# Altium schematic sheet CON_NANOTALK_10WHDRRAMx2.SchDoc: NanoTalk JTAG Headers
size A4; Organization: Altium Limited.; Address1: Level 3, 12a Rodborough Rd; Address2: Frenchs Forest 2086; Address3: NSW; Address4: AUSTRALIA; SheetNumber: 1; SheetTotal: 100
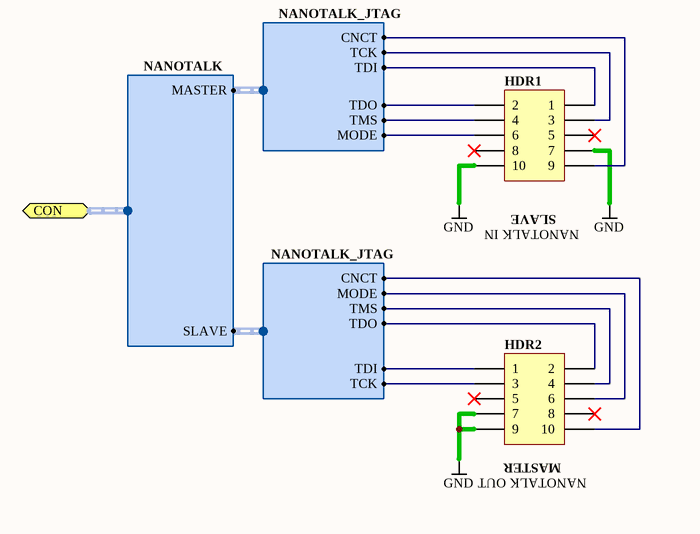
[diagram p0: CON_NANOTALK_10WHDRRAMx2.SchDoc]

## Parts
HDR1  2x5 RA HEADER MALE  [918510x323]  (value not drawn)
HDR2  2x5 RA HEADER  [918510x323]  (value not drawn)

## Ports
CON (harness NANOTALK)

## Harnesses
NANOTALK: MASTER, SLAVE
NANOTALK_JTAG: TDI, TCK, TMS, TDO, MODE, CNCT

## Nets
GND: HDR1.7 HDR1.10 HDR2.7 HDR2.9
NetHDR1_1: HDR1.1 ; harness NANOTALK_JTAG.TDI
NetHDR1_2: HDR1.2 ; harness NANOTALK_JTAG.TDO
NetHDR1_3: HDR1.3 ; harness NANOTALK_JTAG.TCK
NetHDR1_4: HDR1.4 ; harness NANOTALK_JTAG.TMS
NetHDR1_6: HDR1.6 ; harness NANOTALK_JTAG.MODE
NetHDR1_9: HDR1.9 ; harness NANOTALK_JTAG.CNCT
NetHDR2_1: HDR2.1 ; harness NANOTALK_JTAG.TDI
NetHDR2_2: HDR2.2 ; harness NANOTALK_JTAG.TDO
NetHDR2_3: HDR2.3 ; harness NANOTALK_JTAG.TCK
NetHDR2_4: HDR2.4 ; harness NANOTALK_JTAG.TMS
NetHDR2_6: HDR2.6 ; harness NANOTALK_JTAG.MODE
NetHDR2_10: HDR2.10 ; harness NANOTALK_JTAG.CNCT

Not connected (* = marked no-connect by the designer): HDR1 5* 8*; HDR2 5* 8*

## Notes on the sheet
- (near HDR1) SLAVE
- NANOTALK IN
- (near HDR2) MASTER
- (near HDR2) NANOTALK OUT
- Sheet Title
- Project Title
- Size:
- Date:
- A4
- Assy:
- Time:
- Revision:
- Sheet
- of
- File:

## Library data of the parts
HDR1 = D-300-0022: Header IDC, 2 x 5 Pin Right-Angle 2.54mm Pitch (Non-Boxed, Male); Max Current: mA; Category: Connector; Connector type: Header; Mounting Technology: Surface Mount; Pin Count: 10; Status: Production
HDR2 = D-300-0024: Header IDC, 2 x 5 Pin Right-Angle 2.54mm Pitch (Non-Boxed, Male); Max Current: mA; Category: Connector; Connector type: Header; Mounting Technology: Surface Mount; Pin Count: 10; Status: Production